# Altium schematic sheet Memory_Address_Register.SchDoc
size B; Author: E. Sims; Organization: Let's Build Rockets Inc.; SheetNumber: 4; SheetTotal: 16
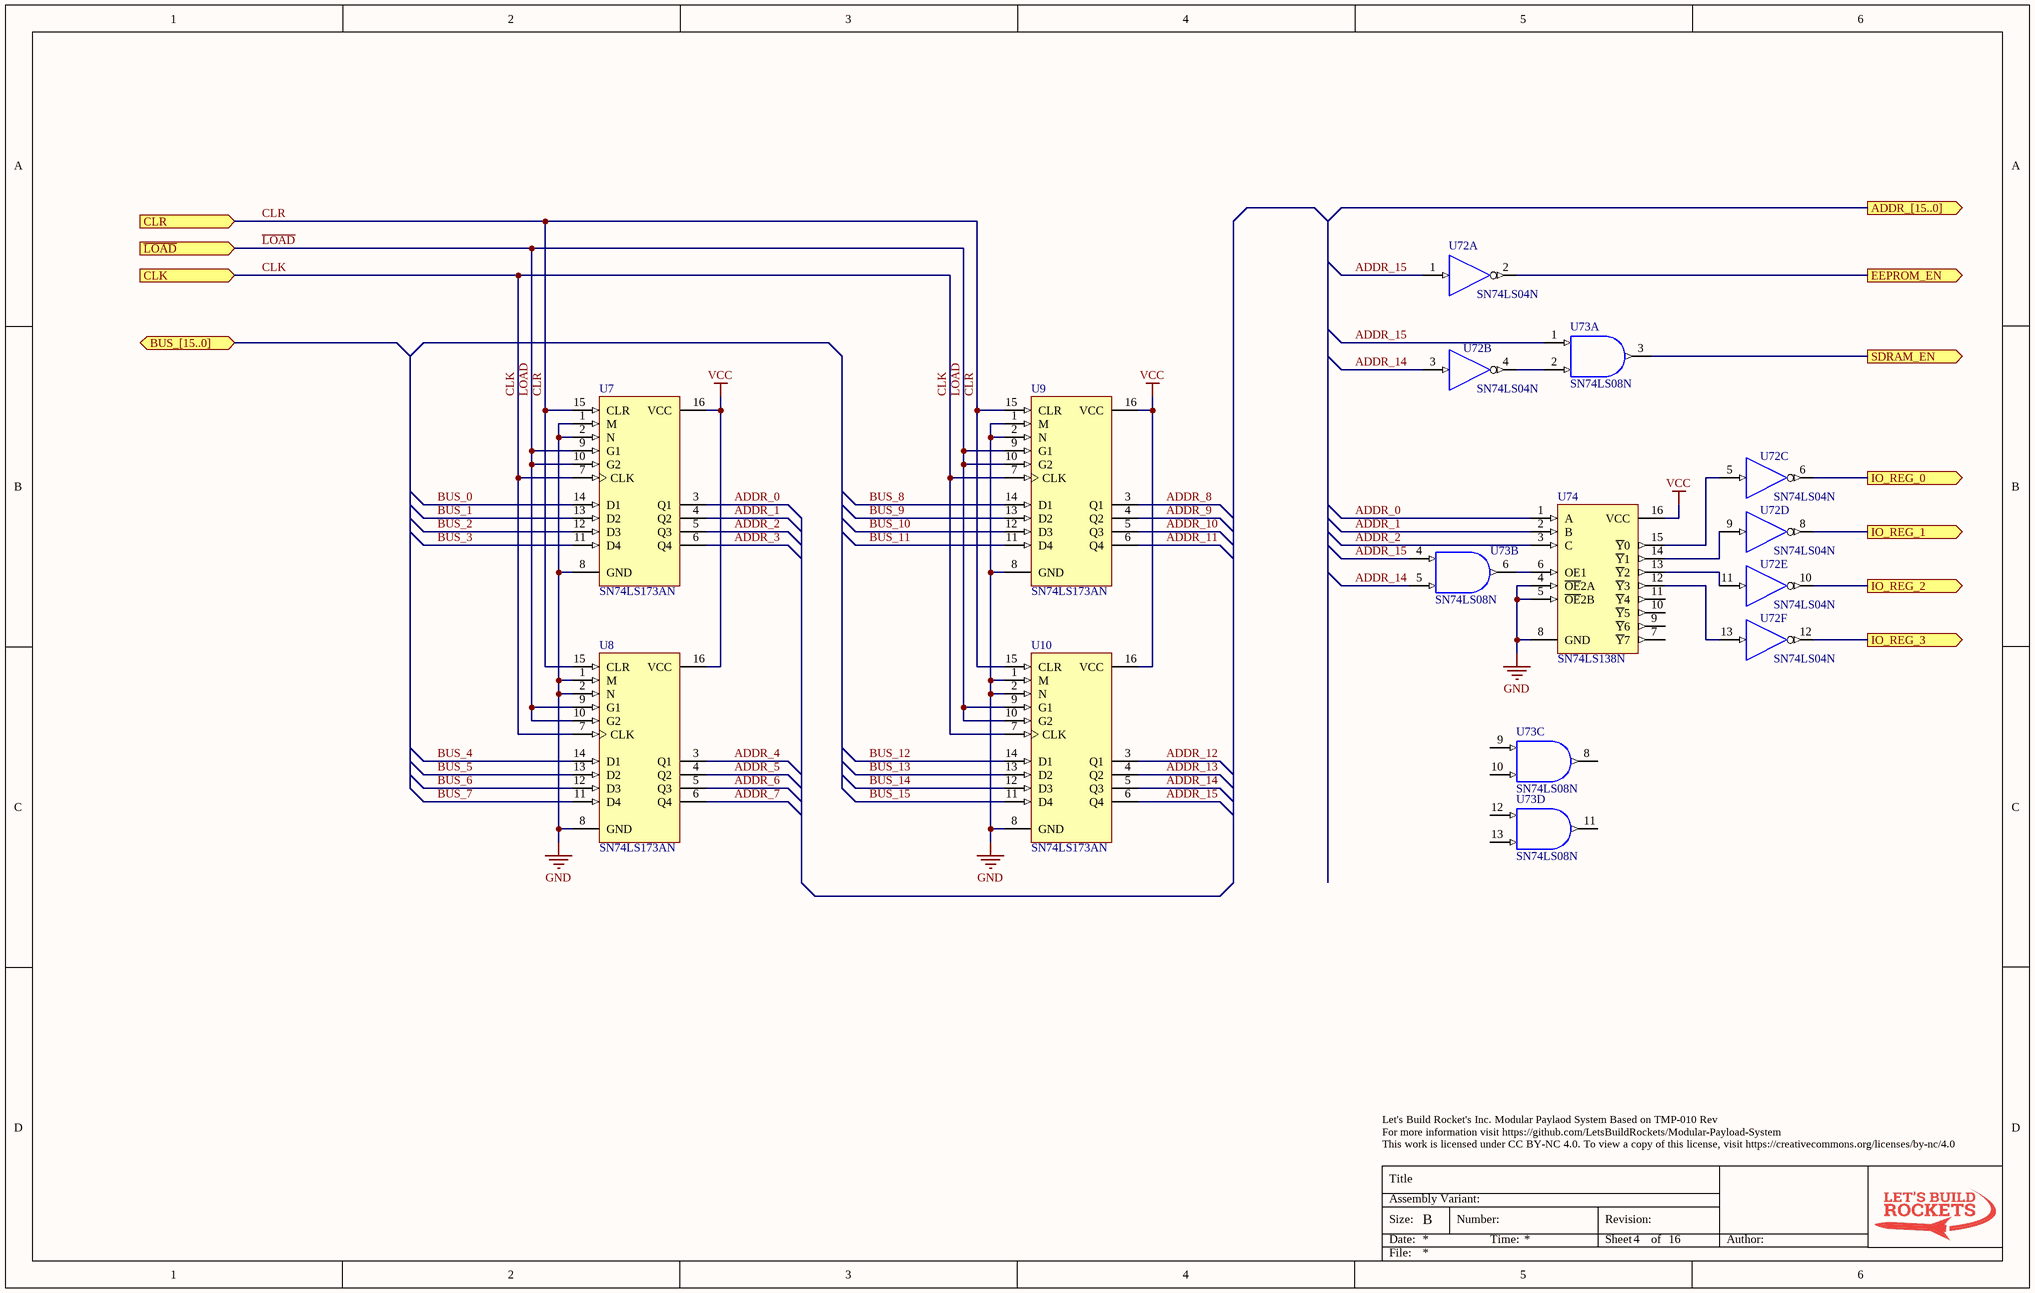
[diagram p0: Memory_Address_Register.SchDoc]

## Parts
U7  SN74LS173AN  [N016D]
U8  SN74LS173AN  [N016D]
U9  SN74LS173AN  [N016D]
U10  SN74LS173AN  [N016D]
U72  SN74LS04N  [N014]  (parts A,B,C,D,E,F of 6)
U73  SN74LS08N  [N014]  (parts A,B,C,D of 4)
U74  SN74LS138N  [N016]

## Ports
ADDR_[15..0] (out), BUS_[15..0] (bidir), CLK (in), CLR (in), EEPROM_EN (out), IO_REG_0 (out), IO_REG_1 (out), IO_REG_2 (out), IO_REG_3 (out), SDRAM_EN (out), ~{LOAD} (in)

## Nets
GND: U7.1(M) U7.2(N) U7.8(GND) U8.1(M) U8.2(N) U8.8(GND) U9.1(M) U9.2(N) U9.8(GND) U10.1(M) U10.2(N) U10.8(GND) U72.7(GND) U73.7(GND) U74.4(~{OE}2A) U74.5(~{OE}2B) U74.8(GND)
VCC: U7.16(VCC) U8.16(VCC) U9.16(VCC) U10.16(VCC) U72.14(VCC) U73.14(VCC) U74.16(VCC)
ADDR_0: U7.3(Q1) U74.1(A)
ADDR_1: U7.4(Q2) U74.2(B)
ADDR_2: U7.5(Q3) U74.3(C)
ADDR_3: U7.6(Q4)
ADDR_4: U8.3(Q1)
ADDR_5: U8.4(Q2)
ADDR_6: U8.5(Q3)
ADDR_7: U8.6(Q4)
ADDR_8: U9.3(Q1)
ADDR_9: U9.4(Q2)
ADDR_10: U9.5(Q3)
ADDR_11: U9.6(Q4)
ADDR_12: U10.3(Q1)
ADDR_13: U10.4(Q2)
ADDR_14: U10.5(Q3) U72.3(A) U73.5(B)
ADDR_15: U10.6(Q4) U72.1(A) U73.1(A) U73.4(A)
BUS_0: U7.14(D1)
BUS_1: U7.13(D2)
BUS_2: U7.12(D3)
BUS_3: U7.11(D4)
BUS_4: U8.14(D1)
BUS_5: U8.13(D2)
BUS_6: U8.12(D3)
BUS_7: U8.11(D4)
BUS_8: U9.14(D1)
BUS_9: U9.13(D2)
BUS_10: U9.12(D3)
BUS_11: U9.11(D4)
BUS_12: U10.14(D1)
BUS_13: U10.13(D2)
BUS_14: U10.12(D3)
BUS_15: U10.11(D4)
CLK: U7.7(CLK) U8.7(CLK) U9.7(CLK) U10.7(CLK) ; port CLK
CLR: U7.15(CLR) U8.15(CLR) U9.15(CLR) U10.15(CLR) ; port CLR
EEPROM_EN: U72.2(Y) ; port EEPROM_EN
IO_REG_0: U72.6(Y) ; port IO_REG_0
IO_REG_1: U72.8(Y) ; port IO_REG_1
IO_REG_2: U72.10(Y) ; port IO_REG_2
IO_REG_3: U72.12(Y) ; port IO_REG_3
~{LOAD}: U7.9(G1) U7.10(G2) U8.9(G1) U8.10(G2) U9.9(G1) U9.10(G2) U10.9(G1) U10.10(G2) ; port ~{LOAD}
SDRAM_EN: U73.3(Y) ; port SDRAM_EN
NetU72_4: U72.4(Y) U73.2(B)
NetU72_5: U72.5(A) U74.15(~{Y}0)
NetU72_9: U72.9(A) U74.14(~{Y}1)
NetU72_11: U72.11(A) U74.13(~{Y}2)
NetU72_13: U72.13(A) U74.12(~{Y}3)
NetU73_6: U73.6(Y) U74.6(OE1)

Not connected (* = marked no-connect by the designer): U73 8(Y) 9(A) 10(B) 11(Y) 12(A) 13(B); U74 7(~{Y}7) 9(~{Y}6) 10(~{Y}5) 11(~{Y}4)

## Notes on the sheet
- Let's Build Rocket's Inc. Modular Paylaod System Based on TMP-010 Rev
  For more information visit https://github.com/LetsBuildRockets/Modular-Payload-System
  This work is licensed under CC BY-NC 4.0. To view a copy of this license, visit https://creativecommons.org/licenses/by-nc/4.0
- Title
- Size:
- Date:
- Assembly Variant:
- B
- Number:
- Time:
- Revision:
- Sheet
- of
- Author:
- File:

## Library data of the parts
U7-U10 = SN74LS173AN: 4-Bit D-Type Register with 3-State Outputs; Published: 8-Jun-2000; LatestRevisionDate: 04-Mar-2005; LatestRevisionNote: Stylized 3D Model Added.; DatasheetVersion: Mar-1988; PackageVersion: Oct-1995; PackageReference: N016D; Publisher: Altium Limited; PackageDescription: DIP; 16 Leads; Row Spacing 7.62 mm; Pitch 2.54 mm; Code_JEDEC: MS-001-BB; ComponentLink1Description: Manufacturer Link; ComponentLink1URL: http://www.ti.com/; ComponentLink2Description: Datasheet; ComponentLink2URL: http://www-s.ti.com/sc/ds/sn74ls173a.pdf
U72 = SN74LS04N: Hex Inverter; Published: 8-Jun-2000; LatestRevisionDate: 04-Mar-2005; LatestRevisionNote: Stylized 3D Model Added.; DatasheetVersion: Mar-1988; PackageVersion: Oct-1995; PackageReference: N014; Publisher: Altium Limited; PackageDescription: DIP; 14 Leads; Row Spacing 7.62 mm; Pitch 2.54 mm; ComponentLink1Description: Manufacturer Link; ComponentLink1URL: http://www.ti.com/; ComponentLink2Description: Datasheet; ComponentLink2URL: http://www-s.ti.com/sc/ds/sn74ls04.pdf
U73 = SN74LS08N: Quadruple 2-Input Positive-AND Gate; Published: 8-Jun-2000; LatestRevisionDate: 04-Mar-2005; LatestRevisionNote: Stylized 3D Model Added.; DatasheetVersion: Mar-1988; PackageVersion: Oct-1995; PackageReference: N014; Publisher: Altium Limited; PackageDescription: DIP; 14 Leads; Row Spacing 7.62 mm; Pitch 2.54 mm; ComponentLink1Description: Manufacturer Link; ComponentLink1URL: http://www.ti.com/; ComponentLink2Description: Datasheet; ComponentLink2URL: http://www-s.ti.com/sc/ds/SN74LS08.pdf
U74 = SN74LS138N: 3-Line to 8-Line Decoder / Demultiplexer; Published: 8-Jun-2000; LatestRevisionDate: 04-Mar-2005; LatestRevisionNote: Stylized 3D Model Added.; DatasheetVersion: Mar-1988; PackageVersion: Oct-1995; PackageReference: N016; Publisher: Altium Limited; PackageDescription: DIP; 16 Leads; Row Spacing 7.62 mm; Pitch 2.54 mm; Code_JEDEC: MS-001-BB; ComponentLink1Description: Manufacturer Link; ComponentLink1URL: http://www.ti.com/; ComponentLink2Description: Datasheet; ComponentLink2URL: http://www-s.ti.com/sc/ds/sn74ls138.pdf